# Altium schematic sheet TopSheet.SchDoc
size A1; SheetNumber: 1; SheetTotal: 3
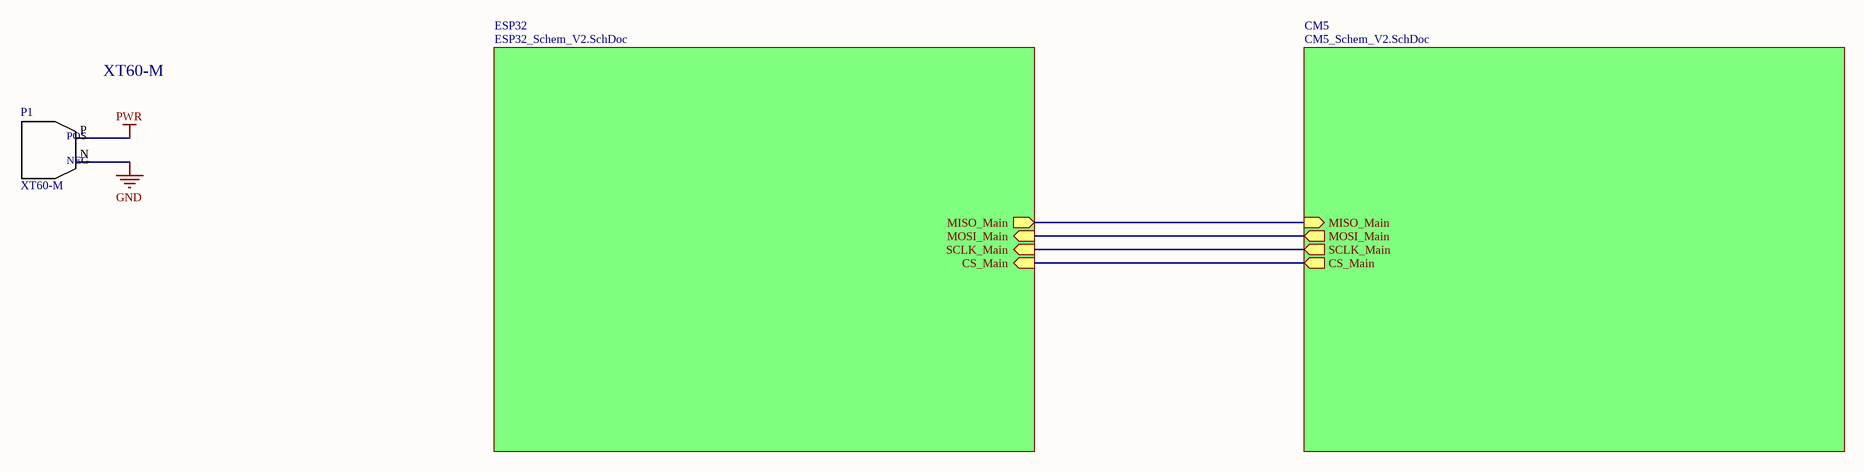
[diagram p0: TopSheet.SchDoc]

## Parts
P1  XT60-M  [AMASS_XT60-M]

## Sub-sheets
CM5 = CM5_Schem_V2.SchDoc: MOSI_Main (out), MISO_Main (in), SCLK_Main (out), CS_Main (out)
ESP32 = ESP32_Schem_V2.SchDoc: MISO_Main (out), MOSI_Main (in), SCLK_Main (in), CS_Main (in)

## Nets
GND: P1.N
PWR: P1.P
(unnamed): sheet ESP32/MISO_Main, sheet CM5/MISO_Main
(unnamed): sheet ESP32/MOSI_Main, sheet CM5/MOSI_Main
(unnamed): sheet ESP32/SCLK_Main, sheet CM5/SCLK_Main
(unnamed): sheet ESP32/CS_Main, sheet CM5/CS_Main

## Notes on the sheet
- XT60-M
- (in symbol XT60-M) POS; NEG

## Library data of the parts
P1 = XT60-M: Plug; DC supply; XT60; male; PIN: 2; for cable; soldered; 30A; 500V; Manufacturer: Changzhou Amass Elec; Manufacturer Part Number: XT60-M.; LCSC Part Number: C98733; Datasheet: https://lcsc.com/datasheet/lcsc_datasheet_2410121856_Changzhou-Amass-Elec-XT60-M-_C98733.pdf